# Altium project stm32_DSP_audio_project.PrjPcb
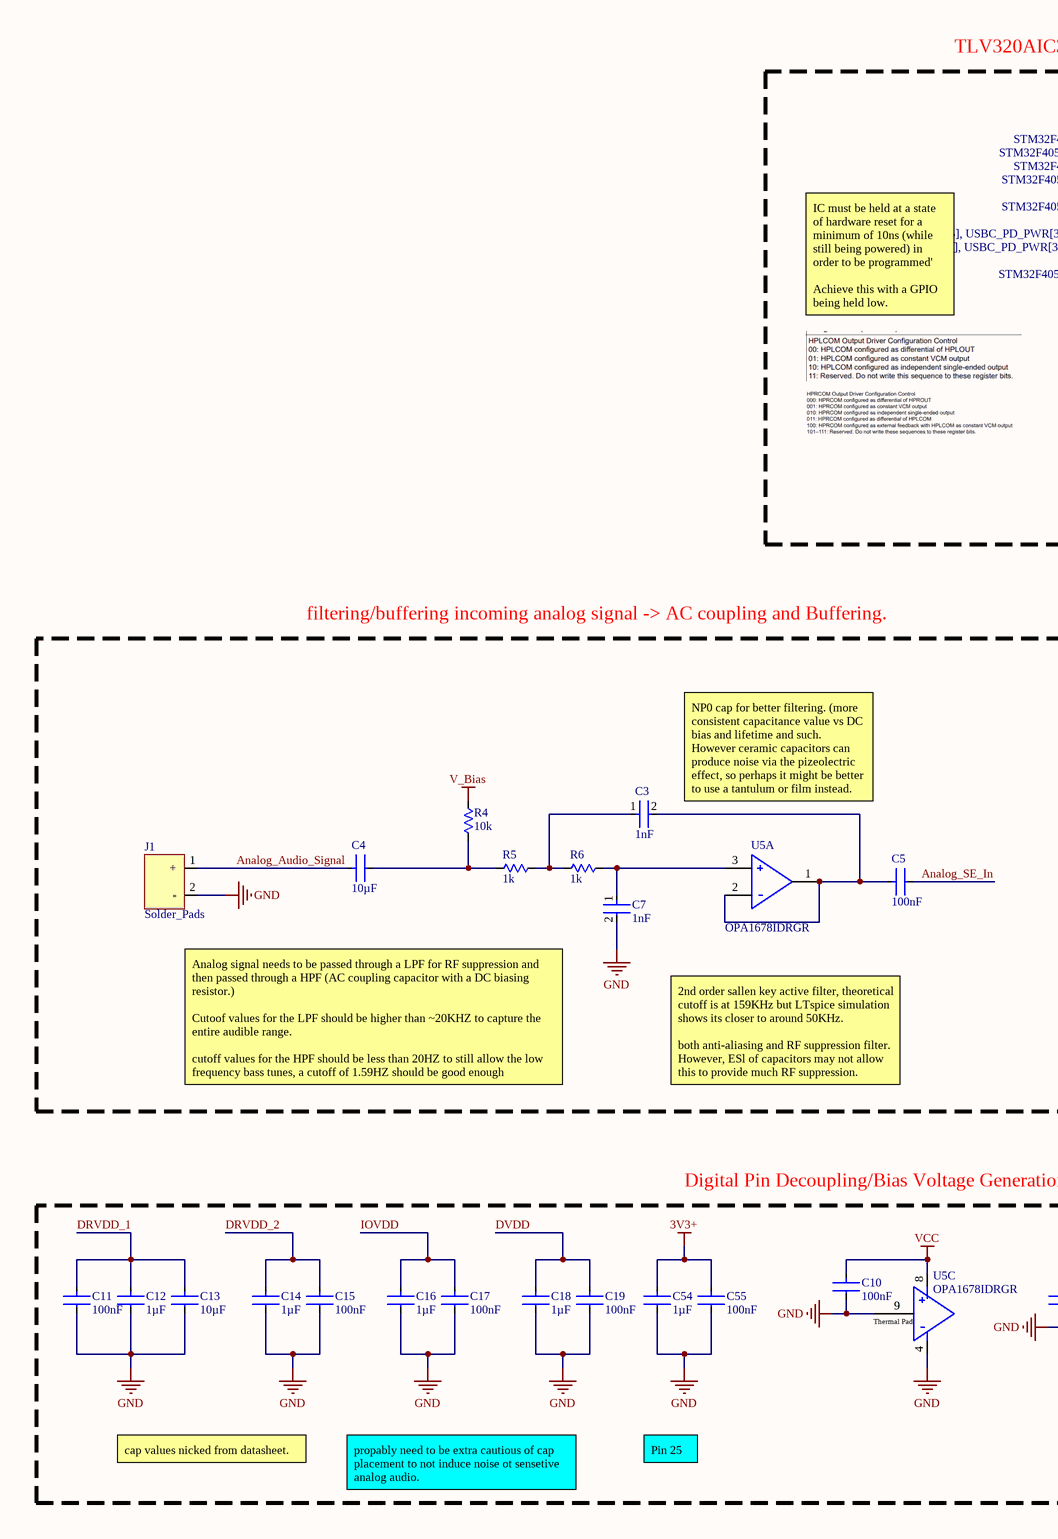
[diagram p0: Audio_Codec_Analog_FrontEnd.SchDoc, left]
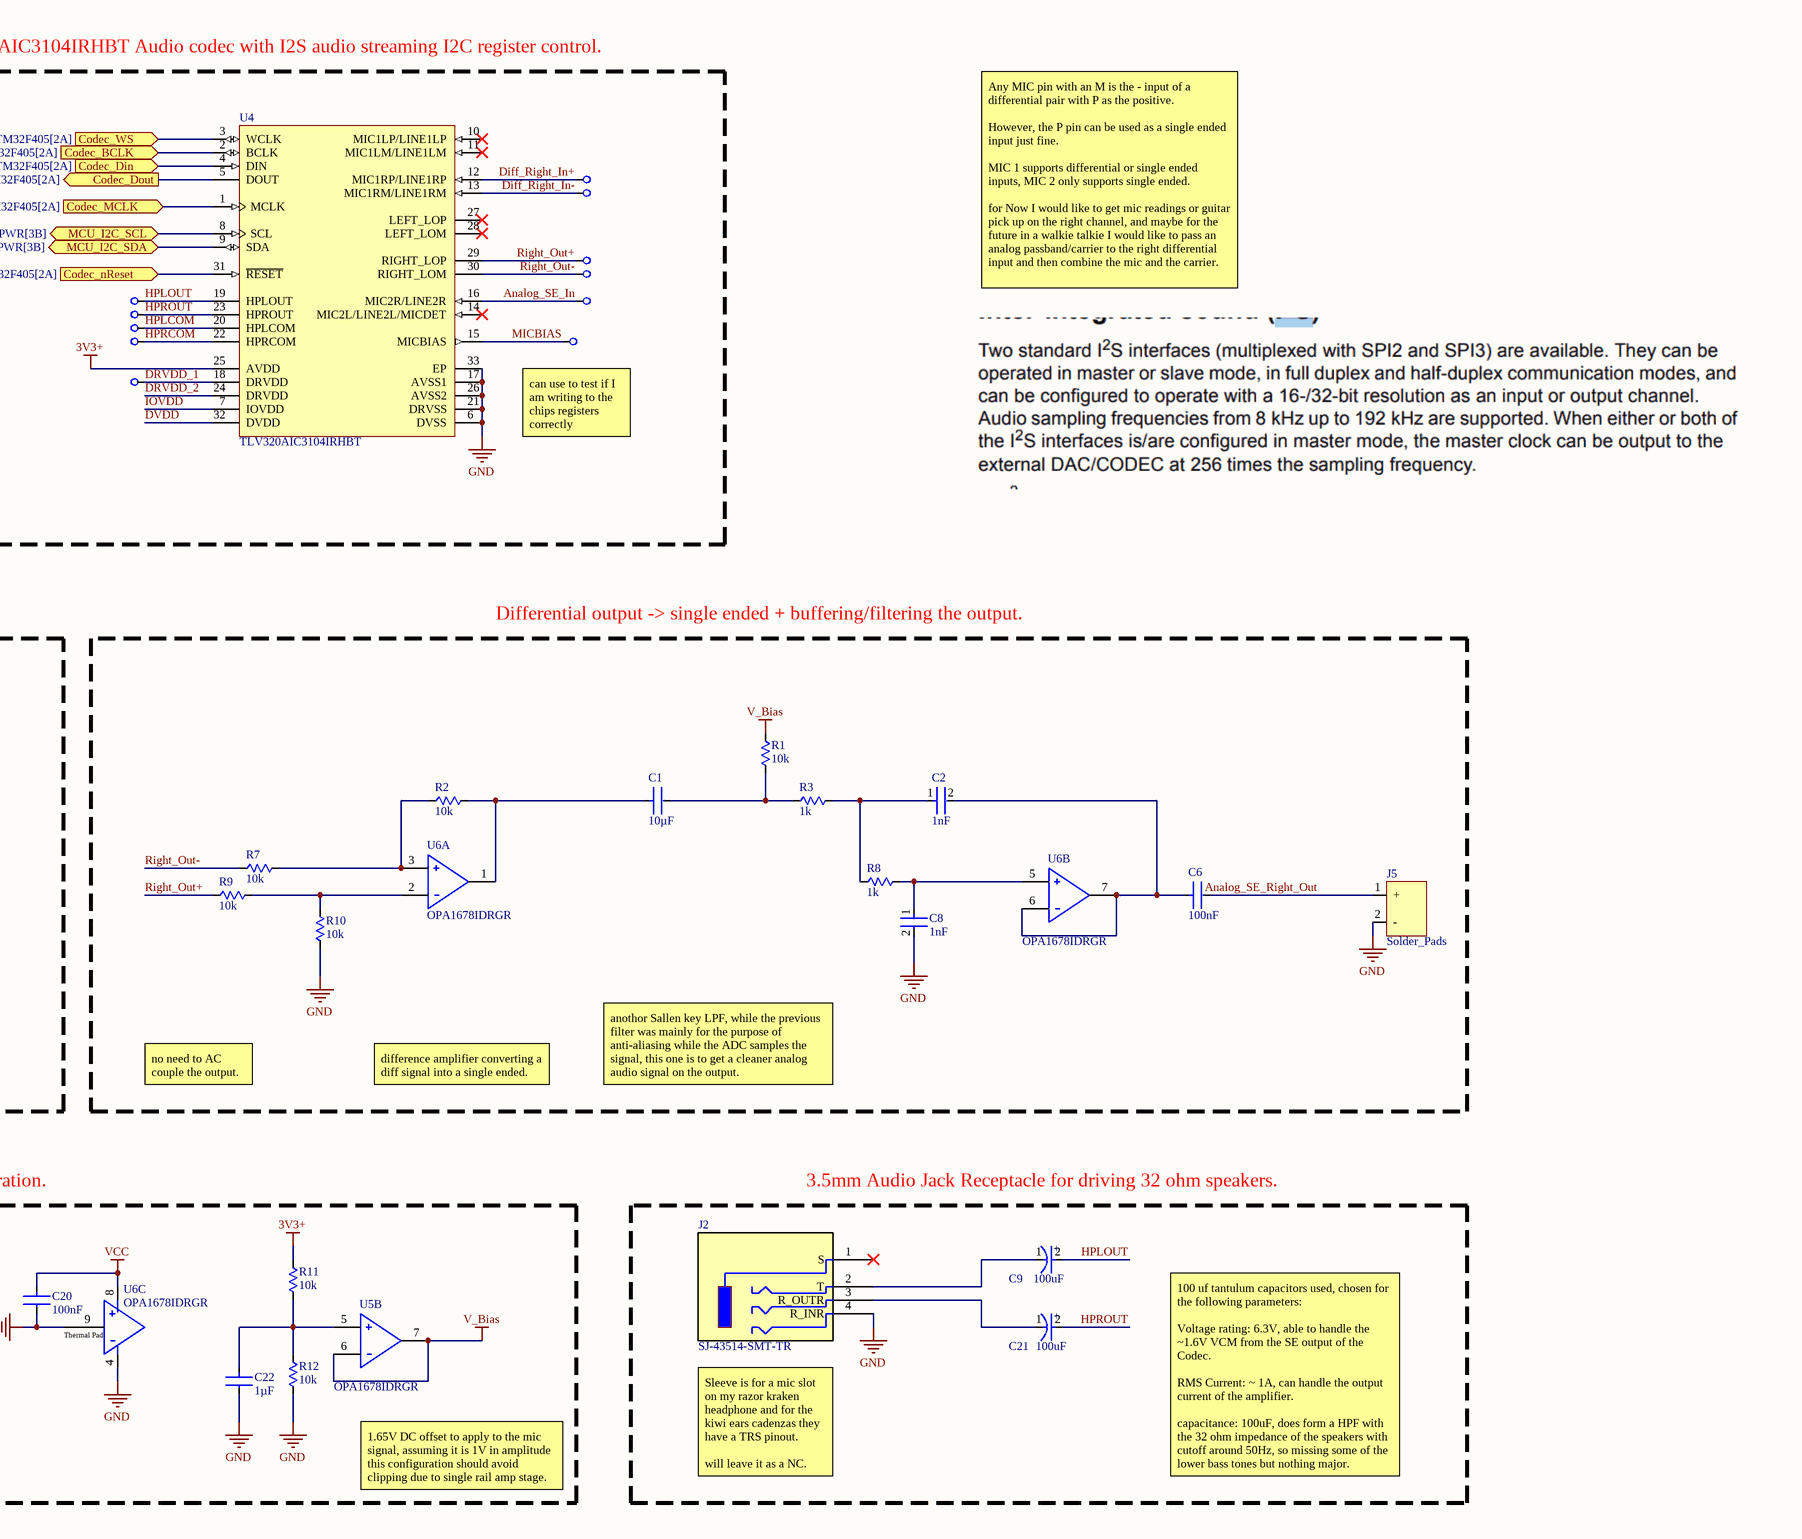
[diagram p1: Audio_Codec_Analog_FrontEnd.SchDoc, right]
3 sheets, 151 parts. Net scope: flat (ports and power ports of the same name join across sheets).
Board file: PCB1.PcbDoc
Sheets:
  Audio_Codec_Analog_FrontEnd.SchDoc
  USBC_PD_PWR.SchDoc
  STM32F405.SchDoc

## Sheet Audio_Codec_Analog_FrontEnd.SchDoc
size 558 x 330 mm; SheetNumber: 1; SheetTotal: 3

### Parts
C1  value 10µF  [MURATA-G_M21B]  (hidden comment: GCM21BC71E106KE36L)
C2  1nF  [FP-GRM188-0_1-e0_2_0_5-IPC_C]
C3  1nF  [FP-GRM188-0_1-e0_2_0_5-IPC_C]
C4  value 10µF  [MURATA-G_M21B]  (hidden comment: GCM21BC71E106KE36L)
C5  value 100nF  [MURATA-G_M188]  (hidden comment: GCM188R71H104KA57D)
C6  value 100nF  [MURATA-G_M188]  (hidden comment: GCM188R71H104KA57D)
C7  1nF  [FP-GRM188-0_1-e0_2_0_5-IPC_C]
C8  1nF  [FP-GRM188-0_1-e0_2_0_5-IPC_C]
C9  Capacitance: 100uF  [FP-TAJB-MFG]  (hidden comment: TAJB107M006RNJ)
C10  value 100nF  [MURATA-G_M188]  (hidden comment: GCM188R71H104KA57D)
C11  value 100nF  [MURATA-G_M188]  (hidden comment: GCM188R71H104KA57D)
C12  value 1µF  [MURATA-G_M188]  (hidden comment: GCM188R71E105KA64D)
C13  value 10µF  [MURATA-G_M21B]  (hidden comment: GCM21BC71E106KE36L)
C14  value 1µF  [MURATA-G_M188]  (hidden comment: GCM188R71E105KA64D)
C15  value 100nF  [MURATA-G_M188]  (hidden comment: GCM188R71H104KA57D)
C16  value 1µF  [MURATA-G_M188]  (hidden comment: GCM188R71E105KA64D)
C17  value 100nF  [MURATA-G_M188]  (hidden comment: GCM188R71H104KA57D)
C18  value 1µF  [MURATA-G_M188]  (hidden comment: GCM188R71E105KA64D)
C19  value 100nF  [MURATA-G_M188]  (hidden comment: GCM188R71H104KA57D)
C20  value 100nF  [MURATA-G_M188]  (hidden comment: GCM188R71H104KA57D)
C21  Capacitance: 100uF  [FP-TAJB-MFG]  (hidden comment: TAJB107M006RNJ)
C22  value 1µF  [MURATA-G_M188]  (hidden comment: GCM188R71E105KA64D)
C54  value 1µF  [MURATA-G_M188]  (hidden comment: GCM188R71E105KA64D)
C55  value 100nF  [MURATA-G_M188]  (hidden comment: GCM188R71H104KA57D)
J1  Solder_Pads  [2_soldering_pads]
J2  SJ-43514-SMT-TR  [SJ-43514-SMT_CUD]
J5  Solder_Pads  [2_soldering_pads]
R1  value 10k  [VISHAY-CRCW0603]  (hidden comment: CRCW060310K0FKTA)
R2  value 10k  [VISHAY-CRCW0603]  (hidden comment: CRCW060310K0FKTA)
R3  value 1k  [VISHAY-TNPW0603]  (hidden comment: TNPW06031K00BEEA)
R4  value 10k  [VISHAY-CRCW0603]  (hidden comment: CRCW060310K0FKTA)
R5  value 1k  [VISHAY-TNPW0603]  (hidden comment: TNPW06031K00BEEA)
R6  value 1k  [VISHAY-TNPW0603]  (hidden comment: TNPW06031K00BEEA)
R7  value 10k  [VISHAY-CRCW0603]  (hidden comment: CRCW060310K0FKTA)
R8  value 1k  [VISHAY-TNPW0603]  (hidden comment: TNPW06031K00BEEA)
R9  value 10k  [VISHAY-CRCW0603]  (hidden comment: CRCW060310K0FKTA)
R10  value 10k  [VISHAY-CRCW0603]  (hidden comment: CRCW060310K0FKTA)
R11  value 10k  [VISHAY-CRCW0603]  (hidden comment: CRCW060310K0FKTA)
R12  value 10k  [VISHAY-CRCW0603]  (hidden comment: CRCW060310K0FKTA)
TP1  Testpoint 1mm  [Testpoint 1mm]  (value not drawn)
TP2  Testpoint 1mm  [Testpoint 1mm]  (value not drawn)
TP3  Testpoint 1mm  [Testpoint 1mm]  (value not drawn)
TP4  Testpoint 1mm  [Testpoint 1mm]  (value not drawn)
TP5  Testpoint 1mm  [Testpoint 1mm]  (value not drawn)
TP6  Testpoint 1mm  [Testpoint 1mm]  (value not drawn)
TP7  Testpoint 1mm  [Testpoint 1mm]  (value not drawn)
TP8  Testpoint 1mm  [Testpoint 1mm]  (value not drawn)
TP9  Testpoint 1mm  [Testpoint 1mm]  (value not drawn)
TP25  Testpoint 1mm  [Testpoint 1mm]  (value not drawn)
TP26  Testpoint 1mm  [Testpoint 1mm]  (value not drawn)
U4  TLV320AIC3104IRHBT  [RHB0032E_V]
U5  OPA1678IDRGR  [FP-DRG0008A-IPC_B]  (parts A,B,C of 3)
U6  OPA1678IDRGR  [FP-DRG0008A-IPC_B]  (parts A,B,C of 3)

### Blocks framed on the sheet
Digital Pin Decoupling/Bias Voltage Generation.: C10-C20 C22 C54 C55 R11 R12 U5 U6
3.5mm Audio Jack Receptacle for driving 32 ohm speakers.: C9 C21 J2

### Ports
Codec_BCLK (in, see STM32F405[2A]), Codec_Din (in, see STM32F405[2A]), Codec_Dout (out, see STM32F405[2A]), Codec_MCLK (in, see STM32F405[2A]), Codec_nReset (in, see STM32F405[2A]), Codec_WS (in, see STM32F405[2A]), MCU_I2C_SCL (bidir, see STM32F405[2B], USBC_PD_PWR[3B]), MCU_I2C_SDA (bidir, see STM32F405[2B], USBC_PD_PWR[3B])

### Nets
3V3+: C54.1 C55.1 R11.2 U4.25(AVDD)
GND: C7.2 C8.2 C10.2 C11.2 C12.2 C13.2 C14.2 C15.2 C16.2 C17.2 C18.2 C19.2 C20.2 C22.2 C54.2 C55.2 J1.2(-) J2.4(R_INR) J5.2(-) R10.2 R12.1 U4.6(DVSS) U4.17(AVSS1) U4.21(DRVSS) U4.26(AVSS2) U4.33(EP) U5.4(OUT_B) U5.9(Thermal_Pad) U6.4(OUT_B) U6.9(Thermal_Pad)
V_Bias: R1.2 R4.2 U5.6(-IN_B) U5.7(OUT_B)
VCC: C10.1 C20.1 U5.8(OUT_B) U6.8(OUT_B)
Analog_Audio_Signal: C4.1 J1.1(+)
Analog_SE_In: C5.2 TP6.1 U4.16(MIC2R/LINE2R)
Analog_SE_Right_Out: C6.2 J5.1(+)
Diff_Right_In+: TP1.1 U4.12(MIC1RP/LINE1RP)
Diff_Right_In-: TP2.1 U4.13(MIC1RM/LINE1RM)
DRVDD_1: C11.1 C12.1 C13.1 TP9.1 U4.18(DRVDD)
DRVDD_2: C14.1 C15.1 U4.24(DRVDD)
DVDD: C18.1 C19.1 U4.32(DVDD)
HPLCOM: TP25.1 U4.20(HPLCOM)
HPLOUT: C9.2(A) TP5.1 U4.19(HPLOUT)
HPRCOM: TP26.1 U4.22(HPRCOM)
HPROUT: C21.2(A) TP7.1 U4.23(HPROUT)
IOVDD: C16.1 C17.1 U4.7(IOVDD)
MCU_GPIO_PB13: U4.31(~{RESET}) ; port Codec_nReset
MCU_I2C_SCL: U4.8(SCL) ; port MCU_I2C_SCL
MCU_I2C_SDA: U4.9(SDA) ; port MCU_I2C_SDA
MCU_I2S_BCLK: U4.2(BCLK) ; port Codec_BCLK
MCU_I2S_ext_SD: U4.5(DOUT) ; port Codec_Dout
MCU_I2S_MCLK: U4.1(MCLK) ; port Codec_MCLK
MCU_I2S_SD: U4.4(DIN) ; port Codec_Din
MCU_I2S_WS: U4.3(WCLK) ; port Codec_WS
MICBIAS: TP8.1 U4.15(MICBIAS)
Right_Out+: R9.2 TP3.1 U4.29(RIGHT_LOP)
Right_Out-: R7.2 TP4.1 U4.30(RIGHT_LOM)
NetC1_1: C1.1 R2.1 U6.1(OUT_B)
NetC1_2: C1.2 R1.1 R3.2
NetC2_1: C2.1 R3.1 R8.2
NetC2_2: C2.2 C6.1 U6.6(-IN_B) U6.7(OUT_B)
NetC3_1: C3.1 R5.1 R6.2
NetC3_2: C3.2 C5.1 U5.1(OUT_B) U5.2(-IN_B)
NetC4_2: C4.2 R4.1 R5.2
NetC7_1: C7.1 R6.1 U5.3(+IN_B)
NetC8_1: C8.1 R8.1 U6.5(+IN_B)
NetC9_1: C9.1(C) J2.2(T)
NetC21_1: C21.1(C) J2.3(R_OUTR)
NetC22_1: C22.1 R11.1 R12.2 U5.5(+IN_B)
NetR2_2: R2.2 R7.1 U6.3(+IN_B)
NetR9_1: R9.1 R10.1 U6.2(-IN_B)

Not connected (* = marked no-connect by the designer): J2 1(S)*; U4 10(MIC1LP/LINE1LP)* 11(MIC1LM/LINE1LM)* 14(MIC2L/LINE2L/MICDET)* 27(LEFT_LOP)* 28(LEFT_LOM)*

### Notes on the sheet
- TLV320AIC3104IRHBT Audio codec with I2S audio streaming I2C register control.
- IC must be held at a state of hardware reset for a minimum of 10ns (while still being powered) in order to be programmed'
  Achieve this with a GPIO being held low.
- Any MIC pin with an M is the - input of a differential pair with P as the positive.
  However, the P pin can be used as a single ended input just fine.
  MIC 1 supports differential or single ended inputs, MIC 2 only supports single ended.
  for Now I would like to get mic readings or guitar pick up on the right channel, and maybe for the future in a walkie talkie I would like to pass an analog passband/carrier to the right differential input and then combine the mic and the carrier.
- (near TP8) can use to test if I am writing to the chips registers correctly
- filtering/buffering incoming analog signal -> AC coupling and Buffering.
- Differential output -> single ended + buffering/filtering the output.
- (near C3) NP0 cap for better filtering. (more consistent capacitance value vs DC bias and lifetime and such.
  However ceramic capacitors can produce noise via the pizeolectric effect, so perhaps it might be better to use a tantulum or film instead.
- Analog signal needs to be passed through a LPF for RF suppression and then passed through a HPF (AC coupling capacitor with a DC biasing resistor.)
  Cutoof values for the LPF should be higher than ~20KHZ to capture the entire audible range.
  cutoff values for the HPF should be less than 20HZ to still allow the low frequency bass tunes, a cutoff of 1.59HZ should be good enough
- 2nd order sallen key active filter, theoretical cutoff is at 159KHz but LTspice simulation shows its closer to around 50KHz.
  both anti-aliasing and RF suppression filter. However, ESl of capacitors may not allow this to provide much RF suppression.
- no need to AC couple the output.
- difference amplifier converting a diff signal into a single ended.
- anothor Sallen key LPF, while the previous filter was mainly for the purpose of anti-aliasing while the ADC samples the signal, this one is to get a cleaner analog audio signal on the output.
- cap values nicked from datasheet.
- Pin 25
- propably need to be extra cautious of cap placement to not induce noise ot sensetive analog audio.
- 1.65V DC offset to apply to the mic signal, assuming it is 1V in amplitude this configuration should avoid clipping due to single rail amp stage.
- Sleeve is for a mic slot on my razor kraken headphone and for the kiwi ears cadenzas they have a TRS pinout.
  will leave it as a NC.
- 100 uf tantulum capacitors used, chosen for the following parameters:
  Voltage rating: 6.3V, able to handle the ~1.6V VCM from the SE output of the Codec.
  RMS Current: ~ 1A, can handle the output current of the amplifier.
  capacitance: 100uF, does form a HPF with the 32 ohm impedance of the speakers with cutoff around 50Hz, so missing some of the lower bass tones but nothing major.
- (in symbol CMP-04424-000592-1) +
- (in symbol CMP-04894-000047-1, part C) Thermal Pad

### Library data of the parts
C1 C4 C13 = CMP-001-02049-3: 10 µF ±10% 25V Ceramic Capacitor X7S 0805 (2012 Metric); Capacitor Type: Ceramic; Mounting Technology: Surface Mount; Min Operating Temperature: 125°C; Case/Package: 0805; Voltage Rating: 25V; Temperature Code: X7S; Tolerance: 10%; Pins: 2; Max Operating Temperature: -55°C
C2 C3 C7 C8 = CMP-1662-00022-2: Chip Multilayer Ceramic Capacitors for General Purpose, 0603, 1000pF, C0G, 30ppm/°C, 5%, 50V; Insulation Resistance: 10GR; Number of Pins: 2; REACH SVHC: No SVHC; Width: 0.8mm; Tolerance: 5%; Termination: SMD/SMT; Thickness: 0.035inch; Height: 0.8mm; Case Code (Imperial): 0603; Length: 1.6mm; Voltage Rating: 50V; Voltage Rating (DC): 50V; Temperature Coefficient: 30ppm/°C; Capacitance: 1nF; Mount: Surface Mount; Lead Free: Lead Free; Max Operating Temperature: 125°C; Min Operating Temperature: -55°C; Packaging: Tape and Reel; Dielectric: C0G; Voltage: 50V; Package Quantity: 1; Material: Ceramic; Case Code (Metric): 1608; Radiation Hardening: No; Depth: 0.8mm; Case/Package: 0603; Dielectric Material: Ceramic
C5 C6 C10 C11 C15 C17 C19 C20 C55 = CMP-001-00243-4: 0.1 µF ±10% 50V Ceramic Capacitor X7R 0603 (1608 Metric); Pins: 2; Temperature Code: X7R; Mounting Technology: Surface Mount; Capacitor Type: Ceramic; Case/Package: 0603; RoHS Compliant: Yes; Tolerance: 10%; Voltage Rating: 50V
C9 C21 = CMP-04424-000592-1: 100uF 6.3V  ±20% 1.7Ω 1210  SMD Tantalum Capacitor; ESR (Equivalent Series Resistance): 1.7R; Leakage Current: 6.3uA; Polarity: Polar; Dissipation Factor: 10%; Termination: SMD/SMT; Max Operating Temperature: 125°C; RoHS Compliant: Yes; Features: General Purpose; Voltage Rating (DC): 6.3V; Width: 2.8mm; Construction: Flat; Length: 3.5mm; Height: 2.1mm; Min Operating Temperature: -55°C; Tolerance: 20%; Lead Free: Lead Free; Mount: Surface Mount; Voltage Rating: 6.3V; Package Quantity: 1; Packaging: Tape and Reel; Case/Package: 1210; Case Code (Imperial): 1210; Depth: 2.8mm; Case Code (Metric): 3528; Series: TAJ; Number of Pins: 2; REACH SVHC: No SVHC; Radiation Hardening: No; Height - Seated (Max): 0.083inch
C12 C14 C16 C18 C22 C54 = CMP-001-00230-4: 1 µF ±10% 25V Ceramic Capacitor X7R 0603 (1608 Metric); Tolerance: 10%; Mounting Technology: Surface Mount; Temperature Code: X7R; Case/Package: 0603; RoHS Compliant: Yes; Pins: 2; Capacitor Type: Ceramic; Voltage Rating: 25V
J2 = SJ-43514-SMT-TR: Description; Manufacturer_Name: Same Sky; Copyright: Copyright (C) 2025 Ultra Librarian. All rights reserved.; Manufacturer_Part_Number: SJ-43514-SMT-TR; RefDes: RefDes; Type: Type
R1 R2 R4 R7 R9-R12 = CMP-009-00002-7: 10 kOhms ±1% 0.1W, 1/10W Chip Resistor 0603 (1608 Metric) Automotive AEC-Q200 Thick Film; Power: 100mW; Voltage Rating: 75V; Max Operating Temperature: 155°C; Pins: 2; Min Operating Temperature: -55°C; RoHS Compliant: No; Tolerance: 1%; Case/Package: 0603; Mounting Technology: Surface Mount
R3 R5 R6 R8 = CMP-009-00212-3: 1 kOhms ±0.1% 0.21W Chip Resistor 0603 (1608 Metric) Anti-Sulfur, Automotive AEC-Q200, Moisture Resistant Thin Film; Voltage Rating: 100V; Power: 100mW; Pins: 2; Mounting Technology: Surface Mount; Tolerance: 0.1%; Case/Package: 0603; Max Operating Temperature: 125°C; RoHS Compliant: Yes; Min Operating Temperature: -55°C
TP1-TP9 TP25 TP26 = CMP-00030-00004-4: Labelled 1mm testpoint pad
U4 = CMP-0331-00065-2: Low-Power Stereo CODEC with 6 Inputs, 6 Outputs, HP Amp and Enhanced Digital Effects, 2 ADCs and 2 DACs, 102 dB DAC SNR, -40 to 85 degC, 32-pin QFN (RHB), Green (RoHS & no Sb/Br); Manufacturer: Texas Instruments; # DACs: 2; Digital Audio Interfaces: L, R, I2S, DSP, TDM; Additional Features: LP Bypass, Notch Filtering, 3D, EQ, Matrix Mixing, PLL; Sampling Rate (Max) (kHz): 96; DAC SNR: 102; Control Interface: I2C; Battery Powered: TRUE; PartNumber: TLV320AIC3104IRHBT; DatasheetVersion: SLAS510C; Code_JEDEC: MO-220; ComponentLink1Description: Datasheet; PackageDescription: 32-Pin Plastic Quad Flat No-Lead, 5 x 5 mm Body, 0.5 mm Pitch, 3.45 x 3.45 mm Exposed Pad; ComponentLink1URL: http://www.ti.com/general/docs/lit/getliterature.tsp?genericPartNumber=TLV320AIC3104&fileType=pdf; # ADCs (typ): 2; Mounting Technology: Surface Mount; PackageVersion: revD, Jun-2011; PackageReference: RHB0032E
U5 U6 = CMP-04894-000047-1: IC AUDIO 2 CIRCUIT 8SON; Input Bias Current: 10pA; Input Offset Voltage (Vos): 500uV; Number of Circuits: 2; Operating Supply Current: 2mA; Slew Rate: 9V/µs; Gain Bandwidth Product: 16MHz; Min Operating Temperature: -40°C; Max Operating Temperature: 85°C; RoHS Compliant: Yes; Mount: Surface Mount; Packaging: Cut Tape; Number of Channels: 2

## Sheet USBC_PD_PWR.SchDoc
size 736 x 304 mm; SheetNumber: 2; SheetTotal: 3
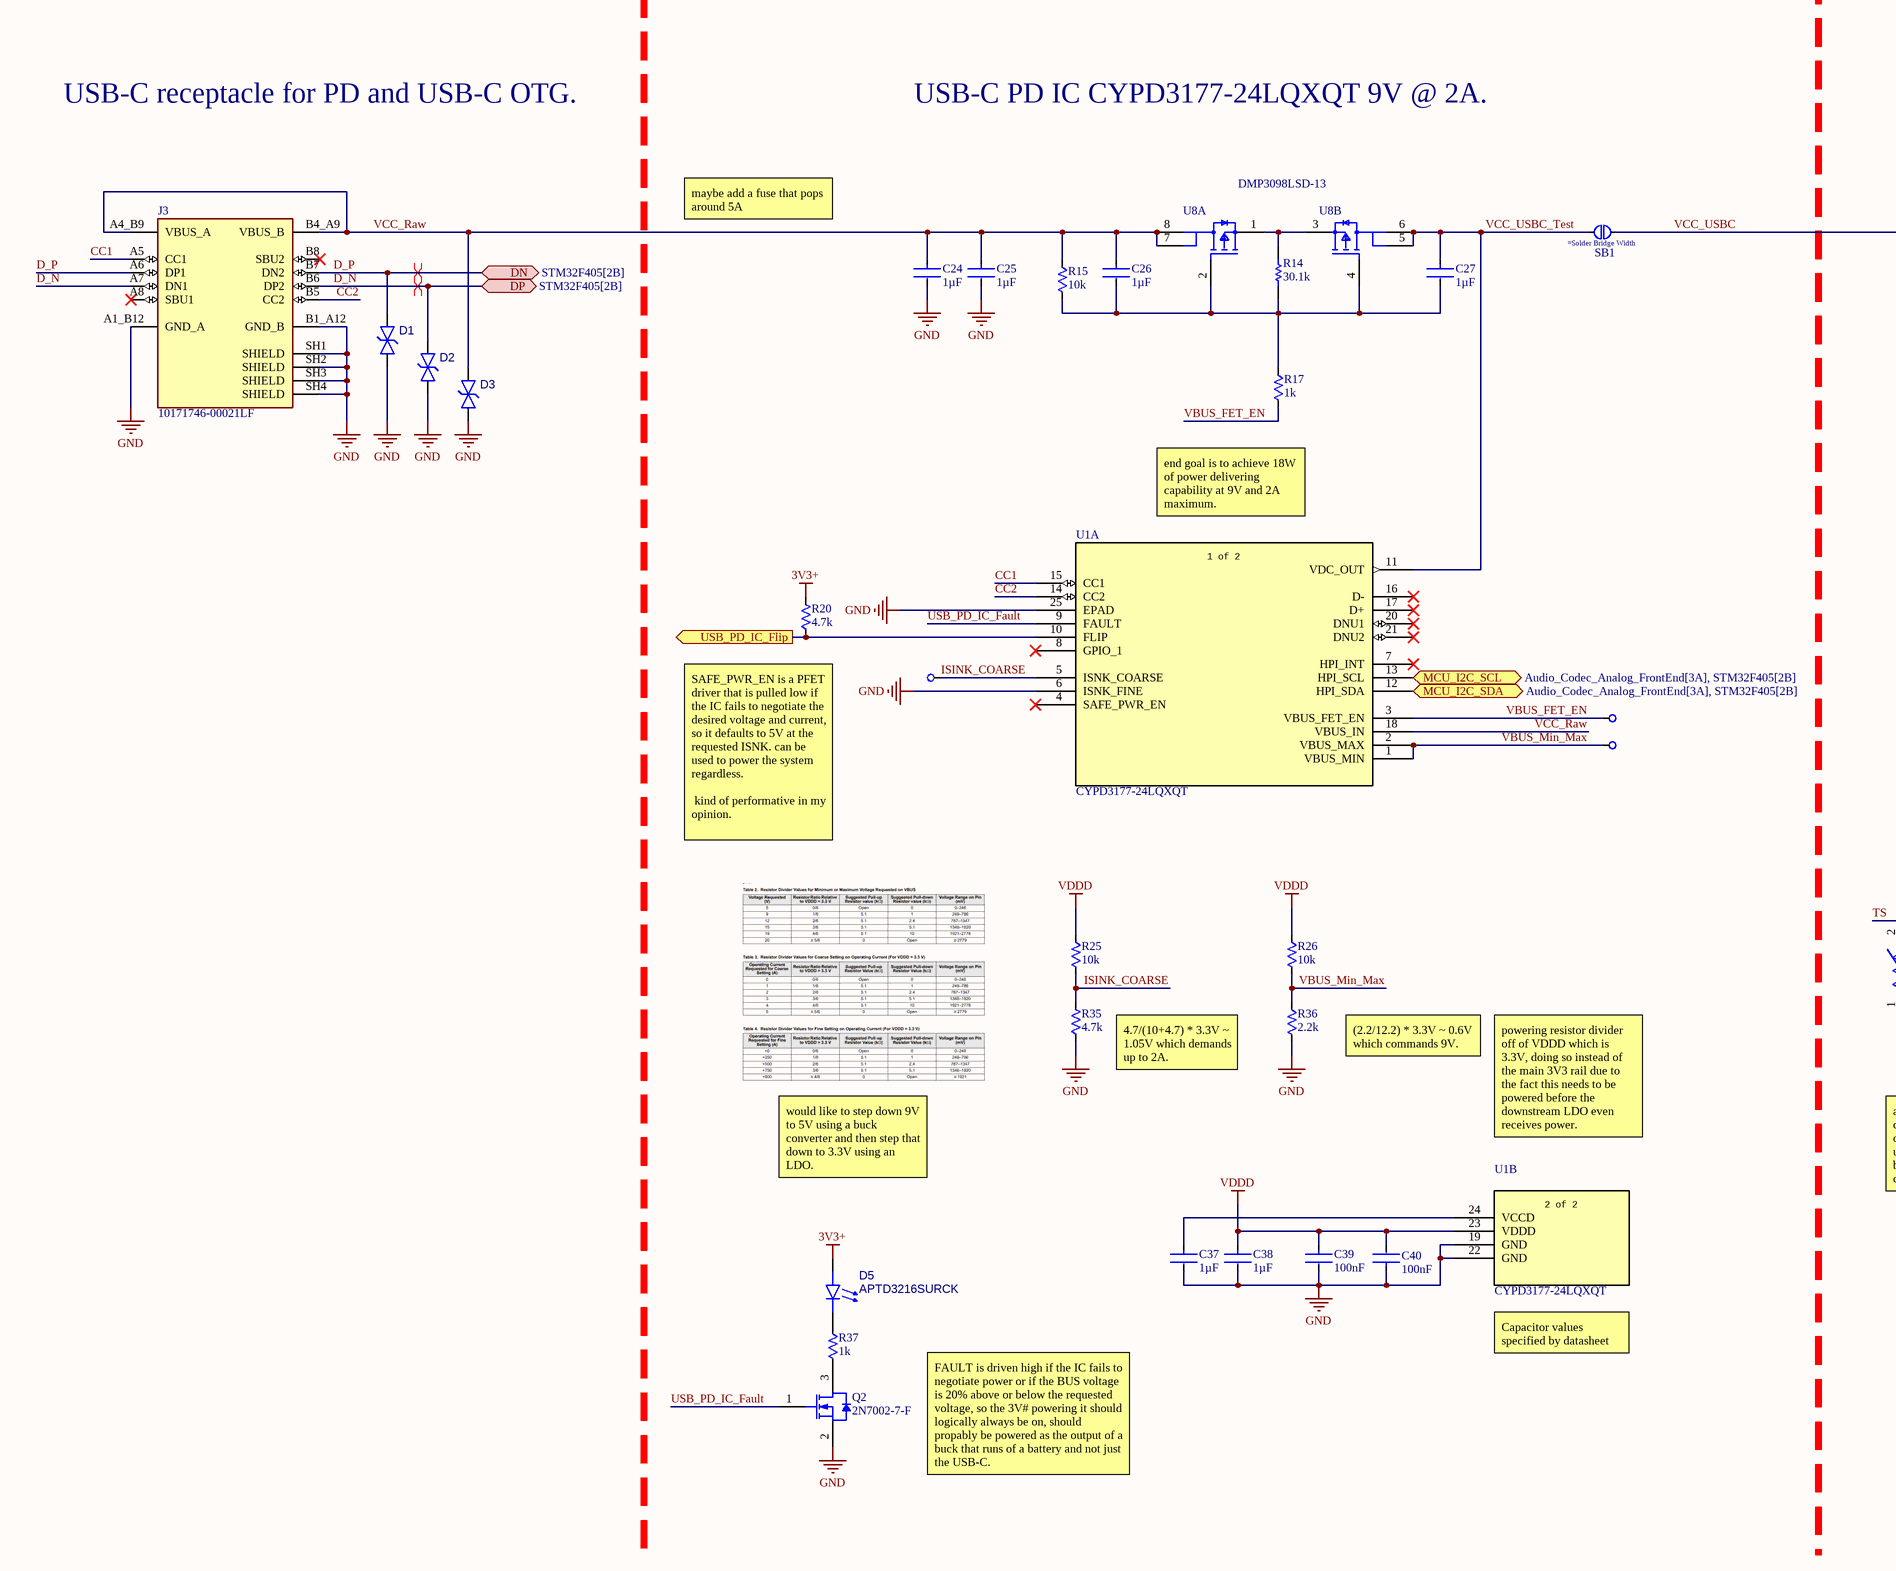
[diagram p2: USBC_PD_PWR.SchDoc, left]
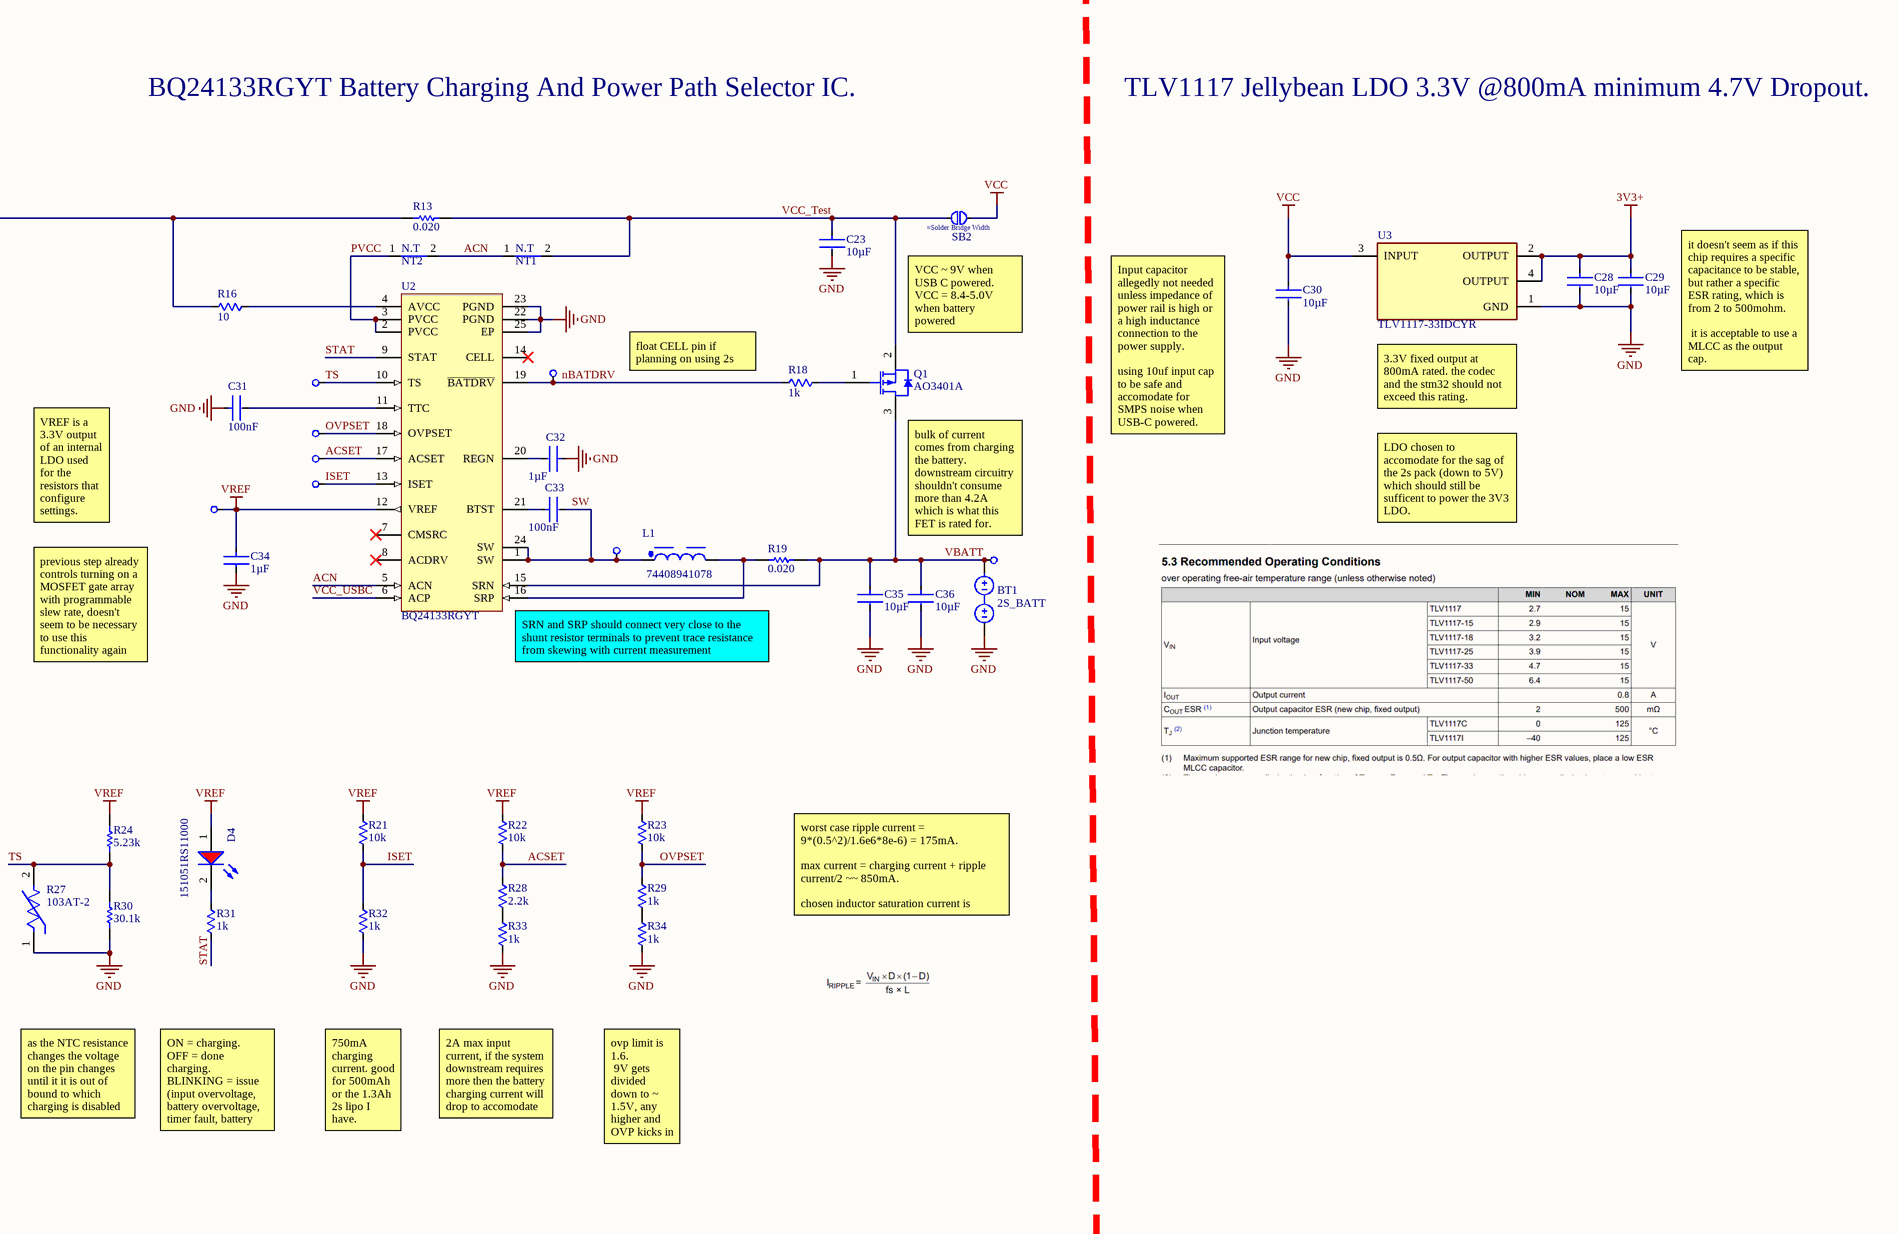
[diagram p3: USBC_PD_PWR.SchDoc, right]

### Parts
BT1  2S_BATT  [2_soldering_pads]
C23  value 10µF  [MURATA-G_M21B]  (hidden comment: GCM21BC71E106KE36L)
C24  value 1µF  [MURATA-G_M188]  (hidden comment: GCM188R71E105KA64D)
C25  value 1µF  [MURATA-G_M188]  (hidden comment: GCM188R71E105KA64D)
C26  value 1µF  [MURATA-G_M188]  (hidden comment: GCM188R71E105KA64D)
C27  value 1µF  [MURATA-G_M188]  (hidden comment: GCM188R71E105KA64D)
C28  value 10µF  [MURATA-G_M21B]  (hidden comment: GCM21BC71E106KE36L)
C29  value 10µF  [MURATA-G_M21B]  (hidden comment: GCM21BC71E106KE36L)
C30  value 10µF  [MURATA-G_M21B]  (hidden comment: GCM21BC71E106KE36L)
C31  value 100nF  [MURATA-G_M188]  (hidden comment: GCM188R71H104KA57D)
C32  value 1µF  [MURATA-G_M188]  (hidden comment: GCM188R71E105KA64D)
C33  value 100nF  [MURATA-G_M188]  (hidden comment: GCM188R71H104KA57D)
C34  value 1µF  [MURATA-G_M188]  (hidden comment: GCM188R71E105KA64D)
C35  value 10µF  [MURATA-G_M21B]  (hidden comment: GCM21BC71E106KE36L)
C36  value 10µF  [MURATA-G_M21B]  (hidden comment: GCM21BC71E106KE36L)
C37  value 1µF  [MURATA-G_M188]  (hidden comment: GCM188R71E105KA64D)
C38  value 1µF  [MURATA-G_M188]  (hidden comment: GCM188R71E105KA64D)
C39  value 100nF  [MURATA-G_M188]  (hidden comment: GCM188R71H104KA57D)
C40  value 100nF  [MURATA-G_M188]  (hidden comment: GCM188R71H104KA57D)
D1  SD12C.TCT  [SDXXC.TCT]  (value not drawn)
D2  SD12C.TCT  [SDXXC.TCT]  (value not drawn)
D3  SD12C.TCT  [SDXXC.TCT]  (value not drawn)
D4  151051RS11000  [WL-TMRC_D5.9H8.7]
D5  APTD3216SURCK  [APTD3216SURCK-Footprint-1]
J3  10171746-00021LF  [AMPHENOL_10171746-00021LF]
L1  74408941078  [WE-SPC_4818]
NT1  Net_Tie  [Net_Tie_150]  (value not drawn)  (net tie, no BOM)
NT2  Net_Tie  [Net_Tie_150]  (value not drawn)  (net tie, no BOM)
Q1  AO3401A  [AO-SOT-23-3L_V]
Q2  2N7002-7-F  [DIODESINC-SOT23]
R13  0.020  [RESC3216X70X50LL05T20]
R14  30.1k  [RESC0603(1608)_N]
R15  value 10k  [VISHAY-CRCW0603]  (hidden comment: CRCW060310K0FKTA)
R16  value 10  [FP-CRCW1206-e3-MFG]  (hidden comment: CRCW120610R0FKEAHP)
R17  value 1k  [VISHAY-TNPW0603]  (hidden comment: TNPW06031K00BEEA)
R18  value 1k  [VISHAY-TNPW0603]  (hidden comment: TNPW06031K00BEEA)
R19  0.020  [RESC3216X70X50LL05T20]
R20  value 4.7k  [VISHAY-CRCW0603]  (hidden comment: CRCW06034K70FKTA)
R21  value 10k  [VISHAY-CRCW0603]  (hidden comment: CRCW060310K0FKTA)
R22  value 10k  [VISHAY-CRCW0603]  (hidden comment: CRCW060310K0FKTA)
R23  value 10k  [VISHAY-CRCW0603]  (hidden comment: CRCW060310K0FKTA)
R24  5.23k  [RESC1608X55X30NL15T15]
R25  value 10k  [VISHAY-CRCW0603]  (hidden comment: CRCW060310K0FKTA)
R26  value 10k  [VISHAY-CRCW0603]  (hidden comment: CRCW060310K0FKTA)
R27  103AT-2  [FP-103AT-2-MFG]
R28  value 2.2k  [VISHAY-CRCW0603]  (hidden comment: CRCW06032K20FKTA)
R29  value 1k  [VISHAY-TNPW0603]  (hidden comment: TNPW06031K00BEEA)
R30  30.1k  [RESC0603(1608)_N]
R31  value 1k  [VISHAY-TNPW0603]  (hidden comment: TNPW06031K00BEEA)
R32  value 1k  [VISHAY-TNPW0603]  (hidden comment: TNPW06031K00BEEA)
R33  value 1k  [VISHAY-TNPW0603]  (hidden comment: TNPW06031K00BEEA)
R34  value 1k  [VISHAY-TNPW0603]  (hidden comment: TNPW06031K00BEEA)
R35  value 4.7k  [VISHAY-CRCW0603]  (hidden comment: CRCW06034K70FKTA)
R36  value 2.2k  [VISHAY-CRCW0603]  (hidden comment: CRCW06032K20FKTA)
R37  value 1k  [VISHAY-TNPW0603]  (hidden comment: TNPW06031K00BEEA)
SB1  SOLDER_BRIDGE  [SOLDER_BRIDGE_60MIL]  (value not drawn)  (net tie, no BOM)
SB2  SOLDER_BRIDGE  [SOLDER_BRIDGE_60MIL]  (value not drawn)  (net tie, no BOM)
TP14  Testpoint 1mm  [Testpoint 1mm]  (value not drawn)
TP15  Testpoint 1mm  [Testpoint 1mm]  (value not drawn)
TP16  Testpoint 1mm  [Testpoint 1mm]  (value not drawn)
TP17  Testpoint 1mm  [Testpoint 1mm]  (value not drawn)
TP18  Testpoint 1mm  [Testpoint 1mm]  (value not drawn)
TP19  Testpoint 1mm  [Testpoint 1mm]  (value not drawn)
TP20  Testpoint 1mm  [Testpoint 1mm]  (value not drawn)
TP21  Testpoint 1mm  [Testpoint 1mm]  (value not drawn)
TP22  Testpoint 1mm  [Testpoint 1mm]  (value not drawn)
TP23  Testpoint 1mm  [Testpoint 1mm]  (value not drawn)
TP24  Testpoint 1mm  [Testpoint 1mm]  (value not drawn)
U1  CYPD3177-24LQXQT  [QFN24_CYPD3177-24LQXQT_INF]  (parts A,B of 2)
U2  BQ24133RGYT  [RGY0024A_V]
U3  TLV1117-33IDCYR  [FP-DCY0004A-MFG]
U8  DMP3098LSD-13  [SOP_DMP3098LSD-13_DIO]  (parts A,B of 2)

### Ports
DN (bidir, see STM32F405[2B]), DP (bidir, see STM32F405[2B]), MCU_I2C_SCL (bidir, see Audio_Codec_Analog_FrontEnd[3A], STM32F405[2B]), MCU_I2C_SDA (bidir, see Audio_Codec_Analog_FrontEnd[3A], STM32F405[2B]), USB_PD_IC_Flip (out)

### Nets
3V3+: C28.1 C29.1 D5.2(A) R20.1 U3.2(OUTPUT) U3.4(OUTPUT)
GND: BT1.2 C23.2 C24.2 C25.2 C28.2 C29.2 C30.2 C31.1 C32.1 C34.2 C35.2 C36.2 C37.2 C38.2 C39.2 C40.1 D1.1(A) D2.1(A) D3.1(A) J3.A1_B12(GND_A) J3.B1_A12(GND_B) J3.SH1(SHIELD) J3.SH2(SHIELD) J3.SH3(SHIELD) J3.SH4(SHIELD) Q2.2(S) R27.1 R30.1 R32.1 R33.1 R34.1 R35.2 R36.1 U1.6(ISNK_FINE) U1.19(GND) U1.22(GND) U1.25(EPAD) U2.22(PGND) U2.23(PGND) U2.25(EP) U3.1(GND)
VCC: C30.1 SB2.2 U3.3(INPUT)
VDDD: C38.1 C39.1 C40.2 R25.2 R26.2 U1.23(VDDD)
VREF: C34.1 D4.1(A) R21.2 R22.2 R23.2 R24.2 TP19.1 U2.12(VREF)
ACN: NT1.1 NT2.2 U2.5(ACN)
ACSET: R22.1 R28.2 TP17.1 U2.17(ACSET)
CC1: J3.A5(CC1) U1.15(CC1)
CC2: J3.B5(CC2) U1.14(CC2)
D_N: D2.2(A) J3.A7(DN1) J3.B6(DP2) ; port DP
D_P: D1.2(A) J3.A6(DP1) J3.B7(DN2) ; port DN
ISET: R21.1 R32.2 TP18.1 U2.13(ISET)
ISINK_COARSE: R25.1 R35.1 TP22.1 U1.5(ISNK_COARSE)
MCU_I2C_SCL: U1.13(HPI_SCL) ; port MCU_I2C_SCL
MCU_I2C_SDA: U1.12(HPI_SDA) ; port MCU_I2C_SDA
nBATDRV: R18.2 TP14.1 U2.19(~{BATDRV})
OVPSET: R23.1 R29.2 TP16.1 U2.18(OVPSET)
PVCC: NT2.1 U2.2(PVCC) U2.3(PVCC)
STAT: R31.1 U2.9(STAT)
SW: C33.2 L1.1 TP20.1 U2.1(SW) U2.24(SW)
TS: R24.1 R27.2 R30.2 TP15.1 U2.10(TS)
USB_PD_IC_Fault: Q2.1(G) U1.9(FAULT)
VBATT: BT1.1 C35.1 C36.1 Q1.3(DRAIN) R19.2 TP21.1 U2.15(SRN)
VBUS_FET_EN: R17.1 TP23.1 U1.3(VBUS_FET_EN)
VBUS_Min_Max: R26.1 R36.2 TP24.1 U1.1(VBUS_MIN) U1.2(VBUS_MAX)
VCC_Raw: C24.1 C25.1 C26.1 D3.2(A) J3.A4_B9(VBUS_A) J3.B4_A9(VBUS_B) R15.2 U1.18(VBUS_IN) U8.7(D1) U8.8(D1)
VCC_Test: C23.1 NT1.2 Q1.2(SOURCE) R13.2 SB2.1
VCC_USBC: R13.1 R16.1 SB1.2 U2.6(ACP)
VCC_USBC_Test: C27.1 SB1.1 U1.11(VDC_OUT) U8.5(D2) U8.6(D2)
NetC26_2: C26.2 C27.2 R14.1 R15.1 R17.2 U8.2(G1) U8.4(G2)
NetC31_2: C31.2 U2.11(TTC)
NetC32_2: C32.2 U2.20(REGN)
NetC33_1: C33.1 U2.21(BTST)
NetC37_1: C37.1 U1.24(VCCD)
NetD4_2: D4.2(K) R31.2
NetD5_1: D5.1(K) R37.2
NetL1_2: L1.2 R19.1 U2.16(SRP)
NetQ1_1: Q1.1(GATE) R18.1
NetQ2_3: Q2.3(D) R37.1
NetR14_2: R14.2 U8.1(S1) U8.3(S2)
NetR16_2: R16.2 U2.4(AVCC)
NetR20_2: R20.2 U1.10(FLIP) ; port USB_PD_IC_Flip
NetR28_1: R28.1 R33.2
NetR29_1: R29.1 R34.2

Not connected (* = marked no-connect by the designer): J3 A8(SBU1)* B8(SBU2)*; U1 4(SAFE_PWR_EN)* 7(HPI_INT)* 8(GPIO_1)* 16(D-)* 17(D+)* 20(DNU1)* 21(DNU2)*; U2 7(CMSRC)* 8(ACDRV)* 14(CELL)*

### Layout directives
differential pair: D_N, D_P

### Notes on the sheet
- USB-C receptacle for PD and USB-C OTG.
- USB-C PD IC CYPD3177-24LQXQT 9V @ 2A.
- BQ24133RGYT Battery Charging And Power Path Selector IC.
- TLV1117 Jellybean LDO 3.3V @800mA minimum 4.7V Dropout.
- maybe add a fuse that pops around 5A
- (near R18) float CELL pin if planning on using 2s battery
- VCC ~ 9V when USB C powered.
  VCC = 8.4-5.0V when battery powered
- it doesn't seem as if this chip requires a specific capacitance to be stable, but rather a specific ESR rating, which is from 2 to 500mohm.
  it is acceptable to use a MLCC as the output cap.
- Input capacitor allegedly not needed unless impedance of  power rail is high or a high inductance connection to the power supply.
  using 10uf input cap to be safe and accomodate for SMPS noise when USB-C powered.
- (near U3) 3.3V fixed output at 800mA rated. the codec and the stm32 should not exceed this rating.
- end goal is to achieve 18W of power delivering capability at 9V and 2A maximum.
- VREF is a 3.3V output of an internal LDO used for the resistors that configure settings.
- bulk of current comes from charging the battery.
  downstream circuitry shouldn't consume more than 4.2A which is what this FET is rated for.
- LDO chosen to accomodate for the sag of the 2s pack (down to 5V) which should still be sufficent to power the 3V3 LDO.
- previous step already controls turning on a MOSFET gate array with programmable slew rate, doesn't seem to be necessary to use this functionality again
- (near U2) SRN and SRP should connect very close to the shunt resistor terminals to prevent trace resistance from skewing with current measurement
- (near R20) SAFE_PWR_EN is a PFET driver that is pulled low if the IC fails to negotiate the desired voltage and current, so it defaults to 5V at the requested ISNK. can be used to power the system regardless.
  kind of performative in my opinion.
- worst case ripple current = 9*(0.5^2)/1.6e6*8e-6) = 175mA.
  max current = charging current + ripple current/2 ~~ 850mA.
  chosen inductor saturation current is 1.95A.
- 4.7/(10+4.7) * 3.3V ~ 1.05V which demands up to 2A.
- (2.2/12.2) * 3.3V ~ 0.6V which commands 9V.
- powering resistor divider off of VDDD which is 3.3V, doing so instead of the main 3V3 rail due to the fact this needs to be powered before the downstream LDO even receives power.
- would like to step down 9V to 5V using a buck converter and then step that down to 3.3V using an LDO.
- as the NTC resistance changes the voltage on the pin changes until it it is out of bound to which charging is disabled
- ON = charging.
  OFF = done charging.
  BLINKING = issue (input overvoltage, battery overvoltage, timer fault, battery absent).
- 750mA charging current. good for 500mAh or the 1.3Ah 2s lipo I have.
- 2A max input current, if the system downstream requires more then the battery charging current will drop to accomodate
- ovp limit is 1.6.
  9V gets divided down to ~ 1.5V, any higher and OVP kicks in
- Capacitor values specified by datasheet
- FAULT is driven high if the IC fails to negotiate power or if the BUS voltage is 20% above or below the requested voltage, so the 3V# powering it should logically always be on, should propably be powered as the output of a buck that runs of a battery and not just the USB-C.
- (in symbol CYPD3177-24LQXQT, part A) 1 of 2
- (in symbol CYPD3177-24LQXQT, part B) 2 of 2
- (in symbol Net_Tie) N.T

### Library data of the parts
C23 C28-C30 C35 C36 = CMP-001-02049-3: as C1 on sheet Audio_Codec_Analog_FrontEnd; Capacitor Type: Ceramic; Mounting Technology: Surface Mount; Min Operating Temperature: 125°C; Case/Package: 0805; Voltage Rating: 25V; Temperature Code: X7S; Tolerance: 10%; Pins: 2; Max Operating Temperature: -55°C
C24-C27 C32 C34 C37 C38 = CMP-001-00230-4: as C12 on sheet Audio_Codec_Analog_FrontEnd; Tolerance: 10%; Mounting Technology: Surface Mount; Temperature Code: X7R; Case/Package: 0603; RoHS Compliant: Yes; Pins: 2; Capacitor Type: Ceramic; Voltage Rating: 25V
C31 C33 C39 C40 = CMP-001-00243-4: as C5 on sheet Audio_Codec_Analog_FrontEnd; Pins: 2; Temperature Code: X7R; Mounting Technology: Surface Mount; Capacitor Type: Ceramic; Case/Package: 0603; RoHS Compliant: Yes; Tolerance: 10%; Voltage Rating: 50V
D1-D3 = CMP-004-00052-2: 24V Clamp 15A (8/20µs) Ipp Tvs Diode Surface Mount SOD-323; Min Operating Temperature: -55°C; Pins: 2; Mounting Technology: Surface Mount; Max Operating Temperature: 125°C
D4 = CMP-1488-00008-3: WL-TMRC Red Color Diffused 5 mm Round Through Hole LED; Manufacturer Lifecycle Status: ACTIVE; Forward Voltage: 2.1V; YEOL: 1 = Estimated lifetime > 10 years; Lens Size: 5mm; Lens Style: Circular, Diffused, Round; Luminous Intensity: 30mcd; Test Current: 20mA; Viewing Angle: 60°; Wavelength: 630nm; Max Reverse Voltage (DC): 5V; Forward Current: 100mA; Dominant Wavelength: 645nm; Peak Wavelength: 650nm; Height: 8.6mm; REACH SVHC: Unknown; Width: 5mm; RoHS: Compliant; Mount: Through Hole; Case/Package: Radial; Min Operating Temperature: -40°C; Length: 5mm; Max Operating Temperature: 85°C; Packaging: Bulk; Color: Red; Lifecycle Status: Production
D5 = CMP-007-00000-1: Single Color LED, Hyper Red, Water Clear, 1.6mm; Forward Current: 30mA; Forward Voltage: 2.5V; Mounting Technology: Surface Mount; Max Operating Temperature: 85°C; Pins: 2; Min Operating Temperature: -40°C; RoHS Compliant: Yes
J3 = CMP-002-00084-1: USB-C (USB TYPE-C) USB 2.0 Receptacle Connector 24 (6+18 Dummy) Position Surface Mount, Right Angle; Through Hole; MF: Amphenol; MP: 10171746-00021LF; Design Item ID: 10171746-00021LF; Component Type: Standard; Case/Package: None; Pins: 16; Check_prices: https://www.snapeda.com/parts/10171746-00021LF/Amphenol/view-part/?ref=eda; Value: *; Source: 10171746-00021LF.SchLib; SnapEDA_Link: https://www.snapeda.com/parts/10171746-00021LF/Amphenol/view-part/?ref=snap
L1 = CMP-1401-00004-3: WE-SPC SMT Shielded Power Inductor; Inductance Tolerance: 20%; DC Resistance (DCR): 195mΩ; Current Rating: 1.05A; Inductance: 7.8µH; Self Resonant Frequency: 35MHz; Core Material: Ferrite; Ambient Temperature Range Low: -40°C; Ambient Temperature Range High: 85°C; Max Operating Temperature: 125°C; Number of Pins: 2; Length: 4.8mm; Min Operating Temperature: -40°C; Width: 4.8mm; Height: 1.8mm; RoHS: Compliant
Q1 = CMP-2000-05778-1: P-Channel MOSFET, 30 V, 4 A, -55 to 150 degC, 3-Pin SOT-23-3L, RoHS, Tape and Reel; Manufacturer: Alpha and Omega; Output Power (Max): NotRequiredW; Power Dissipation: 1.4W; Rad Hardened: No; Drain Efficiency: NotRequired%; Drain-Source On-Volt: 30V; Noise Figure: NotRequireddB; Frequency (Max): NotRequiredMHz; Number of  Elements: 1; Gate-Source Voltage (Max): ?12V; Drain Current (Max): 4A; Channel Mode: Enhancement; Drain-Source On-Res: 0.044ohm; Type: PowerMOSFET; Polarity: P; Package URL: http://www.aosmd.com/res/packaging_information/SOT-23-3L.pdf; Datasheet URL: http://www.aosmd.com/res/data_sheets/AO3401A.pdf; Package Type: SOT-23; Package Description: 3-Pin Small Outline Transistor, Body 2.95 x 1.6 mm, Pitch 0.95 mm; Mounting: SurfaceMount; Manufacturer URL: http://www.aosmd.com/; Continuous Drain Current: 4A; Package Reference: SOT-23-3L; Mounting Technology: SurfaceMount; Operating Temperature Classification: Military; Power Gain: NotRequireddB; Datasheet Version: Rev. 3, 03/2011; Operating Temp Range: -55Cto150C; Pin Count: 3
Q2 = CMP-013-00013-4: N-Channel 60 V 115mA (Ta) 370mW (Ta) Surface Mount SOT-23-3; RoHS Compliant: Yes; Max Operating Temperature: 150°C; Case/Package: SOT-23; Pins: 3
R13 R19 = CMP-2003-00793-1: Manufacturer: Panasonic; Part Number: ERJ8CWFR020V
R14 R30 = CMP-1012-00676-1: 30K1 0.1W 1% 0603 (1608 Metric)  SMD; Case-Metric: 1608; Case-EIA: 0603; Value: 30100.00 Ohm; Tolerance: 1 %; Power: 0.1 W; Technology: SMT
R15 R21-R23 R25 R26 = CMP-009-00002-7: as R1 on sheet Audio_Codec_Analog_FrontEnd; Max Operating Temperature: 155°C; Pins: 2; Min Operating Temperature: -55°C; RoHS Compliant: No; Tolerance: 1%; Case/Package: 0603; Mounting Technology: Surface Mount
R16 = CMP-009-00281-1: RES SMD 10 OHM 1% 3/4W 1206; Voltage Rating: 200V; Power: 750mW; Max Operating Temperature: 155°C; Case/Package: 1206; Min Operating Temperature: -55°C; Mounting Technology: Surface Mount; Tolerance: 1%; Pins: 2
R17 R18 R29 R31-R34 R37 = CMP-009-00212-3: as R3 on sheet Audio_Codec_Analog_FrontEnd; Pins: 2; Mounting Technology: Surface Mount; Tolerance: 0.1%; Case/Package: 0603; Max Operating Temperature: 125°C; RoHS Compliant: Yes; Min Operating Temperature: -55°C
R20 R35 = CMP-009-00003-6: 4.7 kOhms ±1% 0.1W, 1/10W Chip Resistor 0603 (1608 Metric) Automotive AEC-Q200 Thick Film; Power: 100mW; Voltage Rating: 75V; RoHS Compliant: No; Pins: 2; Min Operating Temperature: -55°C; Case/Package: 0603; Max Operating Temperature: 155°C; Mounting Technology: Surface Mount; Tolerance: 1%
R24 = CMP-2000-00550-1: Manufacturer: Panasonic; Part Number: ERJ-3EKF5231V
R27 = CMP-2000-05824-2: Thermistor NTC 10KOhm 1% 2-Pin; Resistance: 10kR; Lead Pitch: 2.54mm; Height: 2.4mm; Max Operating Temperature: 110°C; Width: 3.7mm; RoHS Compliant: Yes; Min Operating Temperature: -50°C; Termination: Radial; Packaging: Bulk; Number of Pins: 2; Series: AT; Tolerance: 1%; Length: 17mm
R28 R36 = CMP-009-00147-4: 2.2 kOhms ±1% 0.1W, 1/10W Chip Resistor 0603 (1608 Metric) Automotive AEC-Q200 Thick Film; Voltage Rating: 75V; Power: 100mW; Min Operating Temperature: -55°C; Tolerance: 1%; Mounting Technology: Surface Mount; Pins: 2; Max Operating Temperature: 155°C; Case/Package: 0603; RoHS Compliant: No
SB1 SB2 = CMP-00030-00002-6: Various 2-pad solder bridge footprints; Pins: 2
TP14-TP24 = CMP-00030-00004-4: Labelled 1mm testpoint pad
U1 = CYPD3177-24LQXQT: EZ-PDâ„¢ Barrel Connector Replacement (BCR) CYPD3177-24LQXQT is the tape and reel packing type option of EZ-PDâ„¢ BCR family, the highly-integrated USB Type-C port controllers for power sink applications. It targets electronic devices using legacy barrel connectors up to 100 W or USB micro-B for power inputs, enabling product designers to replace these incompatible connectors with USB-C.EZ-PDâ„¢ BCR complies with USB Type-C and USB 3.0 Power Delivery (PD) standards and enables users to quickly convert their devices from being powered through a barrel connector to being powered via the USB-C connector with few external components and no firmware development is required. It integrates a complete USB Type-C transceiver, USB PD policy manager, a load switch controller with a soft start, all termination resistors required for a USB Type-C port, and system-level ESD protection. It is available in a 24-pin QFN package.; Manufacturer_Name: Infineon; Copyright: Copyright (C) 2026 Ultra Librarian. All rights reserved.; Manufacturer_Part_Number: CYPD3177-24LQXQT; RefDes: RefDes; Type: Type
U2 = CMP-0321-00108-2: Synchronous Switch-Mode Li-Ion and Li-Polymer Stand-Alone Battery Charger, -40 to 85 degC, 24-pin VQFN (RGY), Green (RoHS & no Sb/Br); Manufacturer: Texas Instruments; Li-Polymer: N; SubFamily: Battery Charge Management; ComponentLink1URL: http://www.ti.com/general/docs/lit/getliterature.tsp?genericPartNumber=BQ24133&fileType=pdf; Over Voltage Protection: N; Code_JEDEC: MO-241-BA; Li-Ion: N; ComponentLink1Description: Datasheet; NiCd: N; NiMH: N; Lead Acid: N; PackageDescription: 24-Leads Plastic Quad Flatpack No-Lead, 5.5 x 3.5 x 0.9 mm Body, 0.5 mm Pitch, Exposed Pad; PackageVersion: revI, Jun-2011; Mounting Technology: Surface Mount; PartNumber: BQ24133RGYT; Eco-Plan: Green (RoHS & no Sb/Br); DatasheetVersion: SLUSAF7B; PackageReference: RGY0024A
U3 = CMP-04917-000056-1: IC REG LIN 3.3V 800MA SOT223-4; Manufacturer: Texas Instruments; Nominal Supply Current: 5mA; Dropout Voltage: 1.2V; Max Supply Voltage: 15V; Min Supply Voltage: 4.7V; Output Type: Fixed; Number Of Outputs: 1; Output Current: 0.8A; Standoff Height: 0.02mm; Max Junction Temp: +125°C; Lead Free: Yes; RoHS: TRUE; Temperature: -40°C to +125°C; Device Class L1: Integrated Circuits (ICs); Output Voltage: 3.3V; Device Class L3: Voltage Regulators - Linear; Octopart: https://octopart.com/tlv1117-33idcyr-texas+instruments-669250; Device Class L2: Power Management ICs; Package: DCY0004A; Temperature Range High: +125°C; Category: IC; Height: 1.8mm; Automotive: No; Digikey Description: IC REG LIN 3.3V 800MA SOT223-4; Temperature Range Low: -40°C; ComponentLink2URL: http://www.ti.com/lit/ds/symlink/tlv1117.pdf; ComponentLink2Description: Datasheet; Manufacturer Part Number: TLV1117-33IDCYR; Mouser Description: LDO Voltage Regulators Fixed LDO Volt Reg
U8 = DMP3098LSD-13: Description; Manufacturer_Name: Diodes Inc; Copyright: Copyright (C) 2025 Ultra Librarian. All rights reserved.; Manufacturer_Part_Number: DMP3098LSD-13; RefDes: RefDes; Type: Type

## Sheet STM32F405.SchDoc
size 406 x 381 mm; SheetNumber: 3; SheetTotal: 3
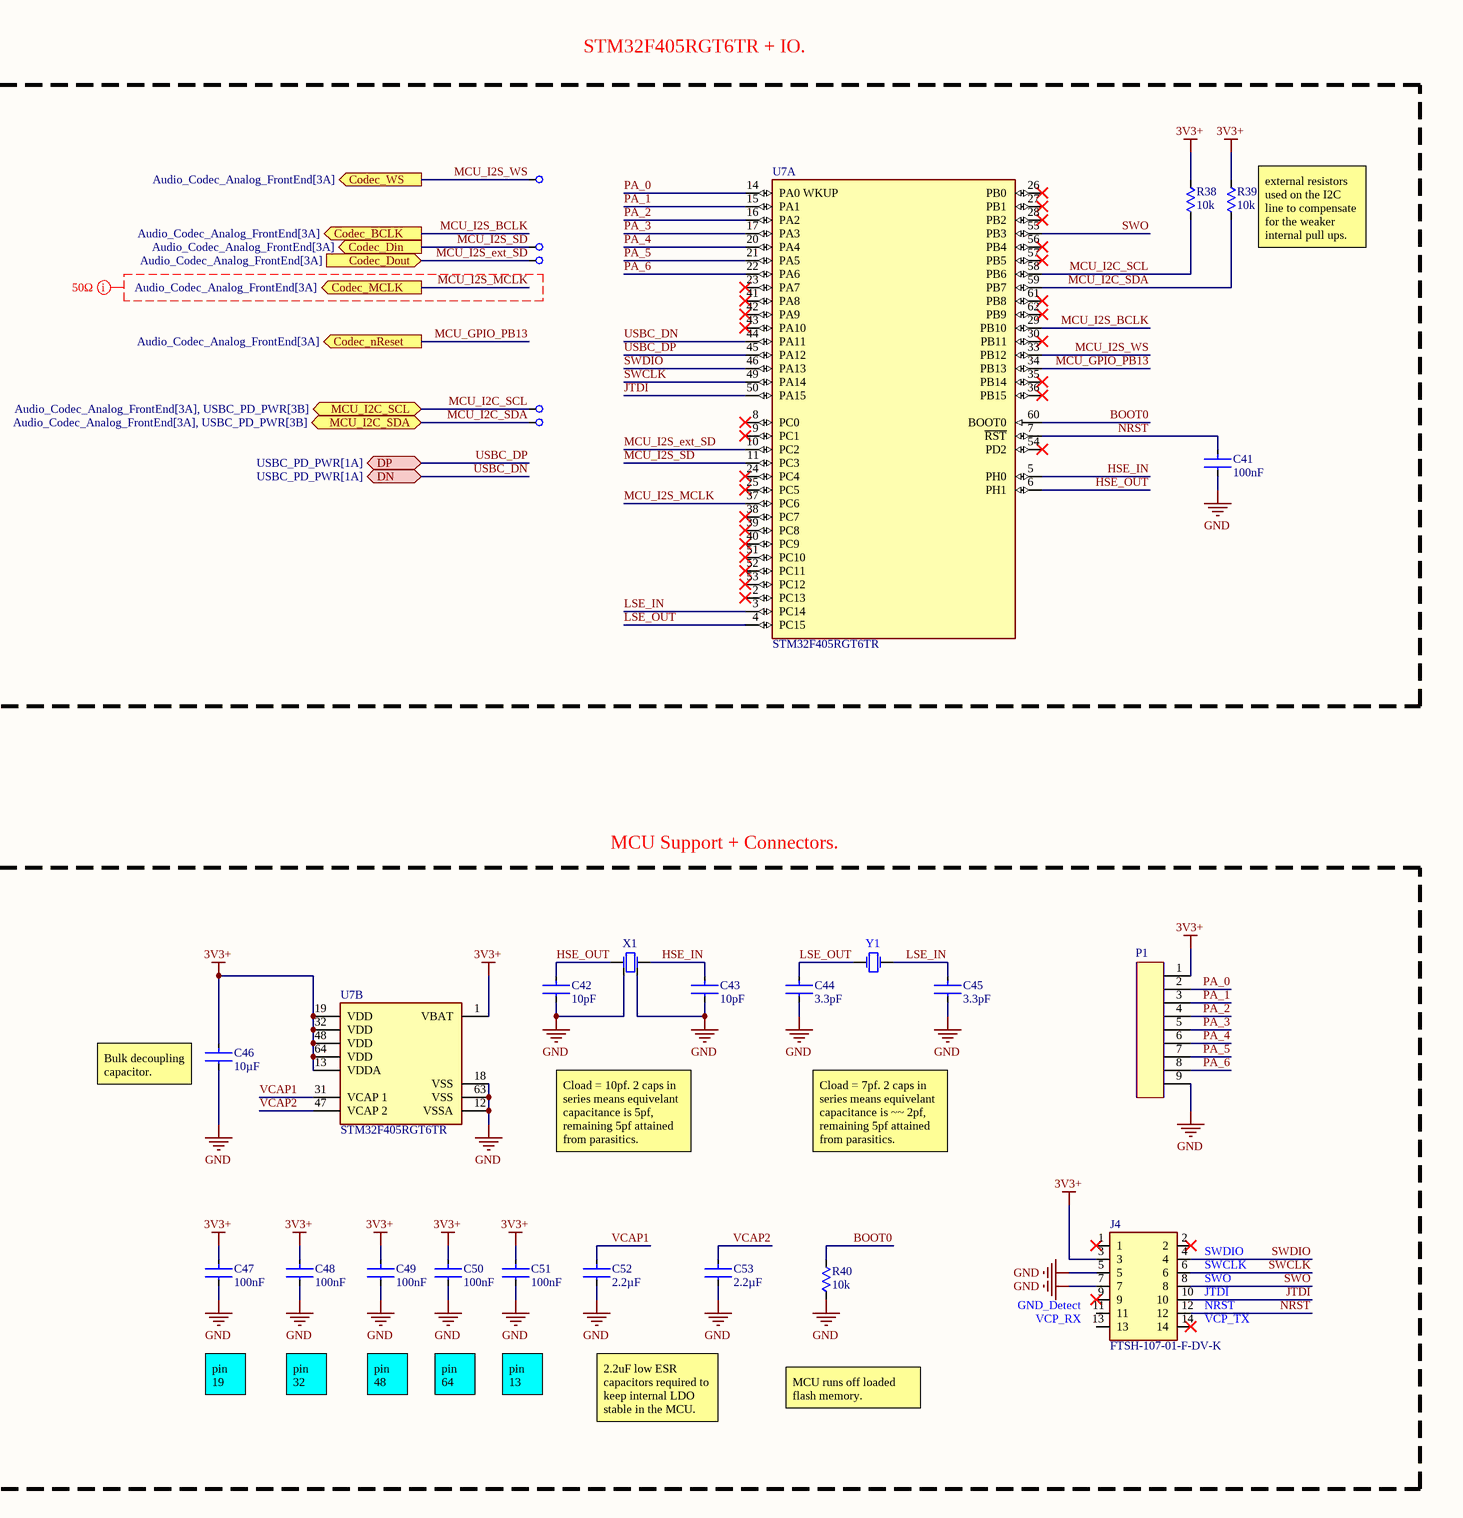
[diagram p4: STM32F405.SchDoc, left]
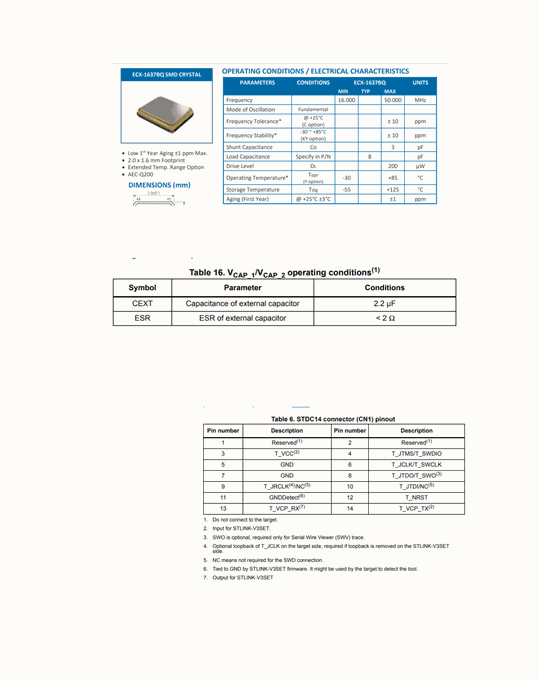
[diagram p5: STM32F405.SchDoc, right]

### Parts
C41  value 100nF  [MURATA-G_M188]  (hidden comment: GCM188R71H104KA57D)
C42  value 10pF  [FP-CL10-MFG]  (hidden comment: CL10C100CB81PNC)
C43  value 10pF  [FP-CL10-MFG]  (hidden comment: CL10C100CB81PNC)
C44  value 3.3pF  [MURATA-G_M188]  (hidden comment: GCM1885C2A3R3CA16D)
C45  value 3.3pF  [MURATA-G_M188]  (hidden comment: GCM1885C2A3R3CA16D)
C46  value 10µF  [MURATA-G_M21B]  (hidden comment: GCM21BC71E106KE36L)
C47  value 100nF  [MURATA-G_M188]  (hidden comment: GCM188R71H104KA57D)
C48  value 100nF  [MURATA-G_M188]  (hidden comment: GCM188R71H104KA57D)
C49  value 100nF  [MURATA-G_M188]  (hidden comment: GCM188R71H104KA57D)
C50  value 100nF  [MURATA-G_M188]  (hidden comment: GCM188R71H104KA57D)
C51  value 100nF  [MURATA-G_M188]  (hidden comment: GCM188R71H104KA57D)
C52  value 2.2µF  [FP-CL10-MFG]  (hidden comment: CL10A225KA8NNNC)
C53  value 2.2µF  [FP-CL10-MFG]  (hidden comment: CL10A225KA8NNNC)
J4  FTSH-107-01-F-DV-K  [FP-FTSH-107-01-F-DV-K-MFG]
P1  61300911121  [61300911121]  (value not drawn)
R38  value 10k  [VISHAY-CRCW0603]  (hidden comment: CRCW060310K0FKTA)
R39  value 10k  [VISHAY-CRCW0603]  (hidden comment: CRCW060310K0FKTA)
R40  value 10k  [VISHAY-CRCW0603]  (hidden comment: CRCW060310K0FKTA)
TP10  Testpoint 1mm  [Testpoint 1mm]  (value not drawn)
TP11  Testpoint 1mm  [Testpoint 1mm]  (value not drawn)
TP12  Testpoint 1mm  [Testpoint 1mm]  (value not drawn)
TP13  Testpoint 1mm  [Testpoint 1mm]  (value not drawn)
TP27  Testpoint 1mm  [Testpoint 1mm]  (value not drawn)
U7  STM32F405RGT6TR  [FP-LQFP64-5W-IPC_C]  (parts A,B of 2)
X1  ECS-250-10-37BQ-CTN-TR  [ECX-1637BQ-ECS]  (value not drawn)
Y1  ECS-.327-7-34QCS-TR  [ECX-34Q-ECS]  (value not drawn)

### Blocks framed on the sheet
MCU Support + Connectors.: C42-C53 J4 P1 R40 U7 X1 Y1

### Ports
Codec_BCLK (out, see Audio_Codec_Analog_FrontEnd[3A]), Codec_Din (out, see Audio_Codec_Analog_FrontEnd[3A]), Codec_Dout (in, see Audio_Codec_Analog_FrontEnd[3A]), Codec_MCLK (out, see Audio_Codec_Analog_FrontEnd[3A]), Codec_nReset (out, see Audio_Codec_Analog_FrontEnd[3A]), Codec_WS (out, see Audio_Codec_Analog_FrontEnd[3A]), DN (bidir, see USBC_PD_PWR[1A]), DP (bidir, see USBC_PD_PWR[1A]), MCU_I2C_SCL (bidir, see Audio_Codec_Analog_FrontEnd[3A], USBC_PD_PWR[3B]), MCU_I2C_SDA (bidir, see Audio_Codec_Analog_FrontEnd[3A], USBC_PD_PWR[3B])

### Nets
3V3+: C46.1 C47.1 C48.1 C49.1 C50.1 C51.1 J4.3 P1.1 R38.2 R39.2 U7.1(VBAT) U7.13(VDDA) U7.19(VDD) U7.32(VDD) U7.48(VDD) U7.64(VDD)
GND: C41.2 C42.2 C43.2 C44.2 C45.2 C46.2 C47.2 C48.2 C49.2 C50.2 C51.2 C52.2 C53.2 J4.5 J4.7 P1.9 R40.2 U7.12(VSSA) U7.18(VSS) U7.63(VSS) X1.2(GND) X1.4(GND)
BOOT0: R40.1 U7.60(BOOT0)
HSE_IN: C43.1 U7.5(PH0) X1.3(Out/In)
HSE_OUT: C42.1 U7.6(PH1) X1.1(In/Out)
JTDI: J4.10 U7.50(PA15)
LSE_IN: C45.1 U7.3(PC14) Y1.2
LSE_OUT: C44.1 U7.4(PC15) Y1.1
MCU_GPIO_PB13: U7.34(PB13) ; port Codec_nReset
MCU_I2C_SCL: R38.1 TP13.1 U7.58(PB6) ; port MCU_I2C_SCL
MCU_I2C_SDA: R39.1 TP27.1 U7.59(PB7) ; port MCU_I2C_SDA
MCU_I2S_BCLK: U7.29(PB10) ; port Codec_BCLK
MCU_I2S_ext_SD: TP12.1 U7.10(PC2) ; port Codec_Dout
MCU_I2S_MCLK: U7.37(PC6) ; port Codec_MCLK
MCU_I2S_SD: TP11.1 U7.11(PC3) ; port Codec_Din
MCU_I2S_WS: TP10.1 U7.33(PB12) ; port Codec_WS
NRST: C41.1 J4.12 U7.7(~{RST})
PA_0: P1.2 U7.14(PA0_WKUP)
PA_1: P1.3 U7.15(PA1)
PA_2: P1.4 U7.16(PA2)
PA_3: P1.5 U7.17(PA3)
PA_4: P1.6 U7.20(PA4)
PA_5: P1.7 U7.21(PA5)
PA_6: P1.8 U7.22(PA6)
SWCLK: J4.6 U7.49(PA14)
SWDIO: J4.4 U7.46(PA13)
SWO: J4.8 U7.55(PB3)
USBC_DN: U7.44(PA11) ; port DN  [project net D_P]
USBC_DP: U7.45(PA12) ; port DP  [project net D_N]
VCAP1: C52.1 U7.31(VCAP_1)
VCAP2: C53.1 U7.47(VCAP_2)

Not connected (* = marked no-connect by the designer): J4 1* 2* 9* 11 13 14*; U7 2(PC13)* 8(PC0)* 9(PC1)* 23(PA7)* 24(PC4)* 25(PC5)* 26(PB0)* 27(PB1)* 28(PB2)* 30(PB11)* 35(PB14)* 36(PB15)* 38(PC7)* 39(PC8)* 40(PC9)* 41(PA8)* 42(PA9)* 43(PA10)* 51(PC10)* 52(PC11)* 53(PC12)* 54(PD2)* 56(PB4)* 57(PB5)* 61(PB8)* 62(PB9)*

### Layout directives
net class 50Ω: MCU_I2S_MCLK

### Notes on the sheet
- STM32F405RGT6TR + IO.
- (near R39) external resistors used on the I2C line to compensate for the weaker internal pull ups.
- (near C46) Bulk decoupling capacitor.
- Cload = 10pf. 2 caps in series means equivelant capacitance is 5pf, remaining 5pf attained from parasitics.
- Cload = 7pf. 2 caps in series means equivelant capacitance is ~~ 2pf, remaining 5pf attained from parasitics.
- (near J4) SWDIO
- (near J4) VCP_RX
- (near J4) GND_Detect
- (near J4) SWCLK
- (near J4) SWO
- (near J4) JTDI
- (near J4) NRST
- (near J4) VCP_TX
- pin 19
- pin 32
- pin 48
- pin 64
- pin 13
- 2.2uF low ESR capacitors required to keep internal LDO stable in the MCU.
- MCU runs off loaded flash memory.

### Library data of the parts
C41 C47-C51 = CMP-001-00243-4: as C5 on sheet Audio_Codec_Analog_FrontEnd; Pins: 2; Temperature Code: X7R; Mounting Technology: Surface Mount; Capacitor Type: Ceramic; Case/Package: 0603; RoHS Compliant: Yes; Tolerance: 10%; Voltage Rating: 50V
C42 C43 = CMP-001-00067-3: 10 pF ±0.25pF 50V Ceramic Capacitor C0G, NP0 0603 (1608 Metric); Tolerance: 2.5%; Max Operating Temperature: 125°C; Pins: 2; Voltage Rating: 50V; RoHS Compliant: Yes; Mounting Technology: Surface Mount; Min Operating Temperature: -55°C; Case/Package: 0603; Capacitor Type: Ceramic
C44 C45 = CMP-001-01629-3: Voltage Rating: 100V; Tolerance: 8%; Capacitor Type: Ceramic; Temperature Code: C0G; Pins: 2; RoHS Compliant: Yes; Mounting Technology: Surface Mount; Case/Package: 0603
C46 = CMP-001-02049-3: as C1 on sheet Audio_Codec_Analog_FrontEnd; Capacitor Type: Ceramic; Mounting Technology: Surface Mount; Min Operating Temperature: 125°C; Case/Package: 0805; Voltage Rating: 25V; Temperature Code: X7S; Tolerance: 10%; Pins: 2; Max Operating Temperature: -55°C
C52 C53 = CMP-001-00072-7: 2.2 µF ±10% 25V Ceramic Capacitor X5R 0603 (1608 Metric); Min Operating Temperature: -55°C; Capacitor Type: Ceramic; Case/Package: 0603; Max Operating Temperature: 85°C; Mounting Technology: Surface Mount; RoHS Compliant: Yes; Pins: 2
J4 = CMP-002-00009-3: Board Connector, 14 Contact(s), 2 Row(s), Male, Straight, 0.05 inch Pitch, Surface Mount Terminal, Locking; Connector Type: BOARD CONNECTOR; RoHS Compliant: Yes; Mounting Technology: Board
P1 = CMP-002-00072-1: Board Connector, 9 Contact(s), 1 Row(s), Male, Straight, 0.1 inch Pitch, Solder Terminal, Locking, Black Insulator, Plug; Max Operating Temperature: 125°C; Mounting Technology: Board; Min Operating Temperature: -40°C; Connector Type: BOARD CONNECTOR; RoHS Compliant: Yes
R38-R40 = CMP-009-00002-7: as R1 on sheet Audio_Codec_Analog_FrontEnd; Max Operating Temperature: 155°C; Pins: 2; Min Operating Temperature: -55°C; RoHS Compliant: No; Tolerance: 1%; Case/Package: 0603; Mounting Technology: Surface Mount
TP10-TP13 TP27 = CMP-00030-00004-4: Labelled 1mm testpoint pad
U7 = CMP-0243-00156-2: IC MCU 32BIT 1MB FLASH 64LQFP; Frequency: 168MHz; Number of SPI Channels: 3; Oscillator Type: Internal; Core Architecture: ARM; Number of UART Channels: 2; Max Supply Voltage: 3.6V; Watchdog Timer: Yes; RAM Size: 196KB; Interface: I2C; Max Power Dissipation: 435mW; Number of Timers/Counters: 14; Data Bus Width: 32b; Peripherals: Brown-out Detect/Reset; Number of ADC Channels: 16; Min Supply Voltage: 1.8V; Number of Programmable I/O: 51; Memory Size: 1024KB; Max Operating Temperature: 85°C; Package Quantity: 1000; Lead Free: Lead Free; Memory Type: FLASH; Case/Package: LQFP; Number of I2C Channels: 3; Contact Plating: Tin; Mount: Surface Mount; Min Operating Temperature: -40°C; Radiation Hardening: No; Number of USB Channels: 2; Packaging: Tape and Reel; Height: 1.45mm; Number of Pins: 64; Number of I/Os: 51; Max Frequency: 168MHz; Width: 10mm; Length: 10mm
X1 = CMP-003-00007-1: 25 MHz ±10ppm Crystal 10pF 50 Ohms, Automotive AEC-Q200, 4-SMD, No Lead; ESR: 50; Frequency: 25MHz; Min Operating Temperature: -40°C; Load Capacitance: 10pF; RoHS Compliant: Yes; Pins: 4; Mounting Technology: Surface Mount; Max Operating Temperature: 85°C
Y1 = CMP-003-00006-2: 32.768 kHz ±10ppm Crystal 7pF 70 kOhms, Automotive AEC-Q200, 2-SMD, No Lead; ESR: 70k; Max Operating Temperature: 125°C; Min Operating Temperature: -40°C; Frequency: 32.768kHz; Load Capacitance: 7pF; RoHS Compliant: Yes; Mounting Technology: Surface Mount; Pins: 2

## Nets that join several sheets
3V3+: Audio_Codec_Analog_FrontEnd (C54.1 C55.1 R11.2 U4.25), USBC_PD_PWR (6 pins), STM32F405 (16 pins)
GND: Audio_Codec_Analog_FrontEnd (30 pins), USBC_PD_PWR (41 pins), STM32F405 (22 pins)
VCC: Audio_Codec_Analog_FrontEnd (C10.1 C20.1 U5.8 U6.8), USBC_PD_PWR (C30.1 SB2.2 U3.3)
D_N: USBC_PD_PWR (D2.2 J3.A7 J3.B6), STM32F405 (U7.45)
D_P: USBC_PD_PWR (D1.2 J3.A6 J3.B7), STM32F405 (U7.44)
MCU_GPIO_PB13: Audio_Codec_Analog_FrontEnd (U4.31), STM32F405 (U7.34)
MCU_I2C_SCL: Audio_Codec_Analog_FrontEnd (U4.8), USBC_PD_PWR (U1.13), STM32F405 (R38.1 TP13.1 U7.58)
MCU_I2C_SDA: Audio_Codec_Analog_FrontEnd (U4.9), USBC_PD_PWR (U1.12), STM32F405 (R39.1 TP27.1 U7.59)
MCU_I2S_BCLK: Audio_Codec_Analog_FrontEnd (U4.2), STM32F405 (U7.29)
MCU_I2S_ext_SD: Audio_Codec_Analog_FrontEnd (U4.5), STM32F405 (TP12.1 U7.10)
MCU_I2S_MCLK: Audio_Codec_Analog_FrontEnd (U4.1), STM32F405 (U7.37)
MCU_I2S_SD: Audio_Codec_Analog_FrontEnd (U4.4), STM32F405 (TP11.1 U7.11)
MCU_I2S_WS: Audio_Codec_Analog_FrontEnd (U4.3), STM32F405 (TP10.1 U7.33)